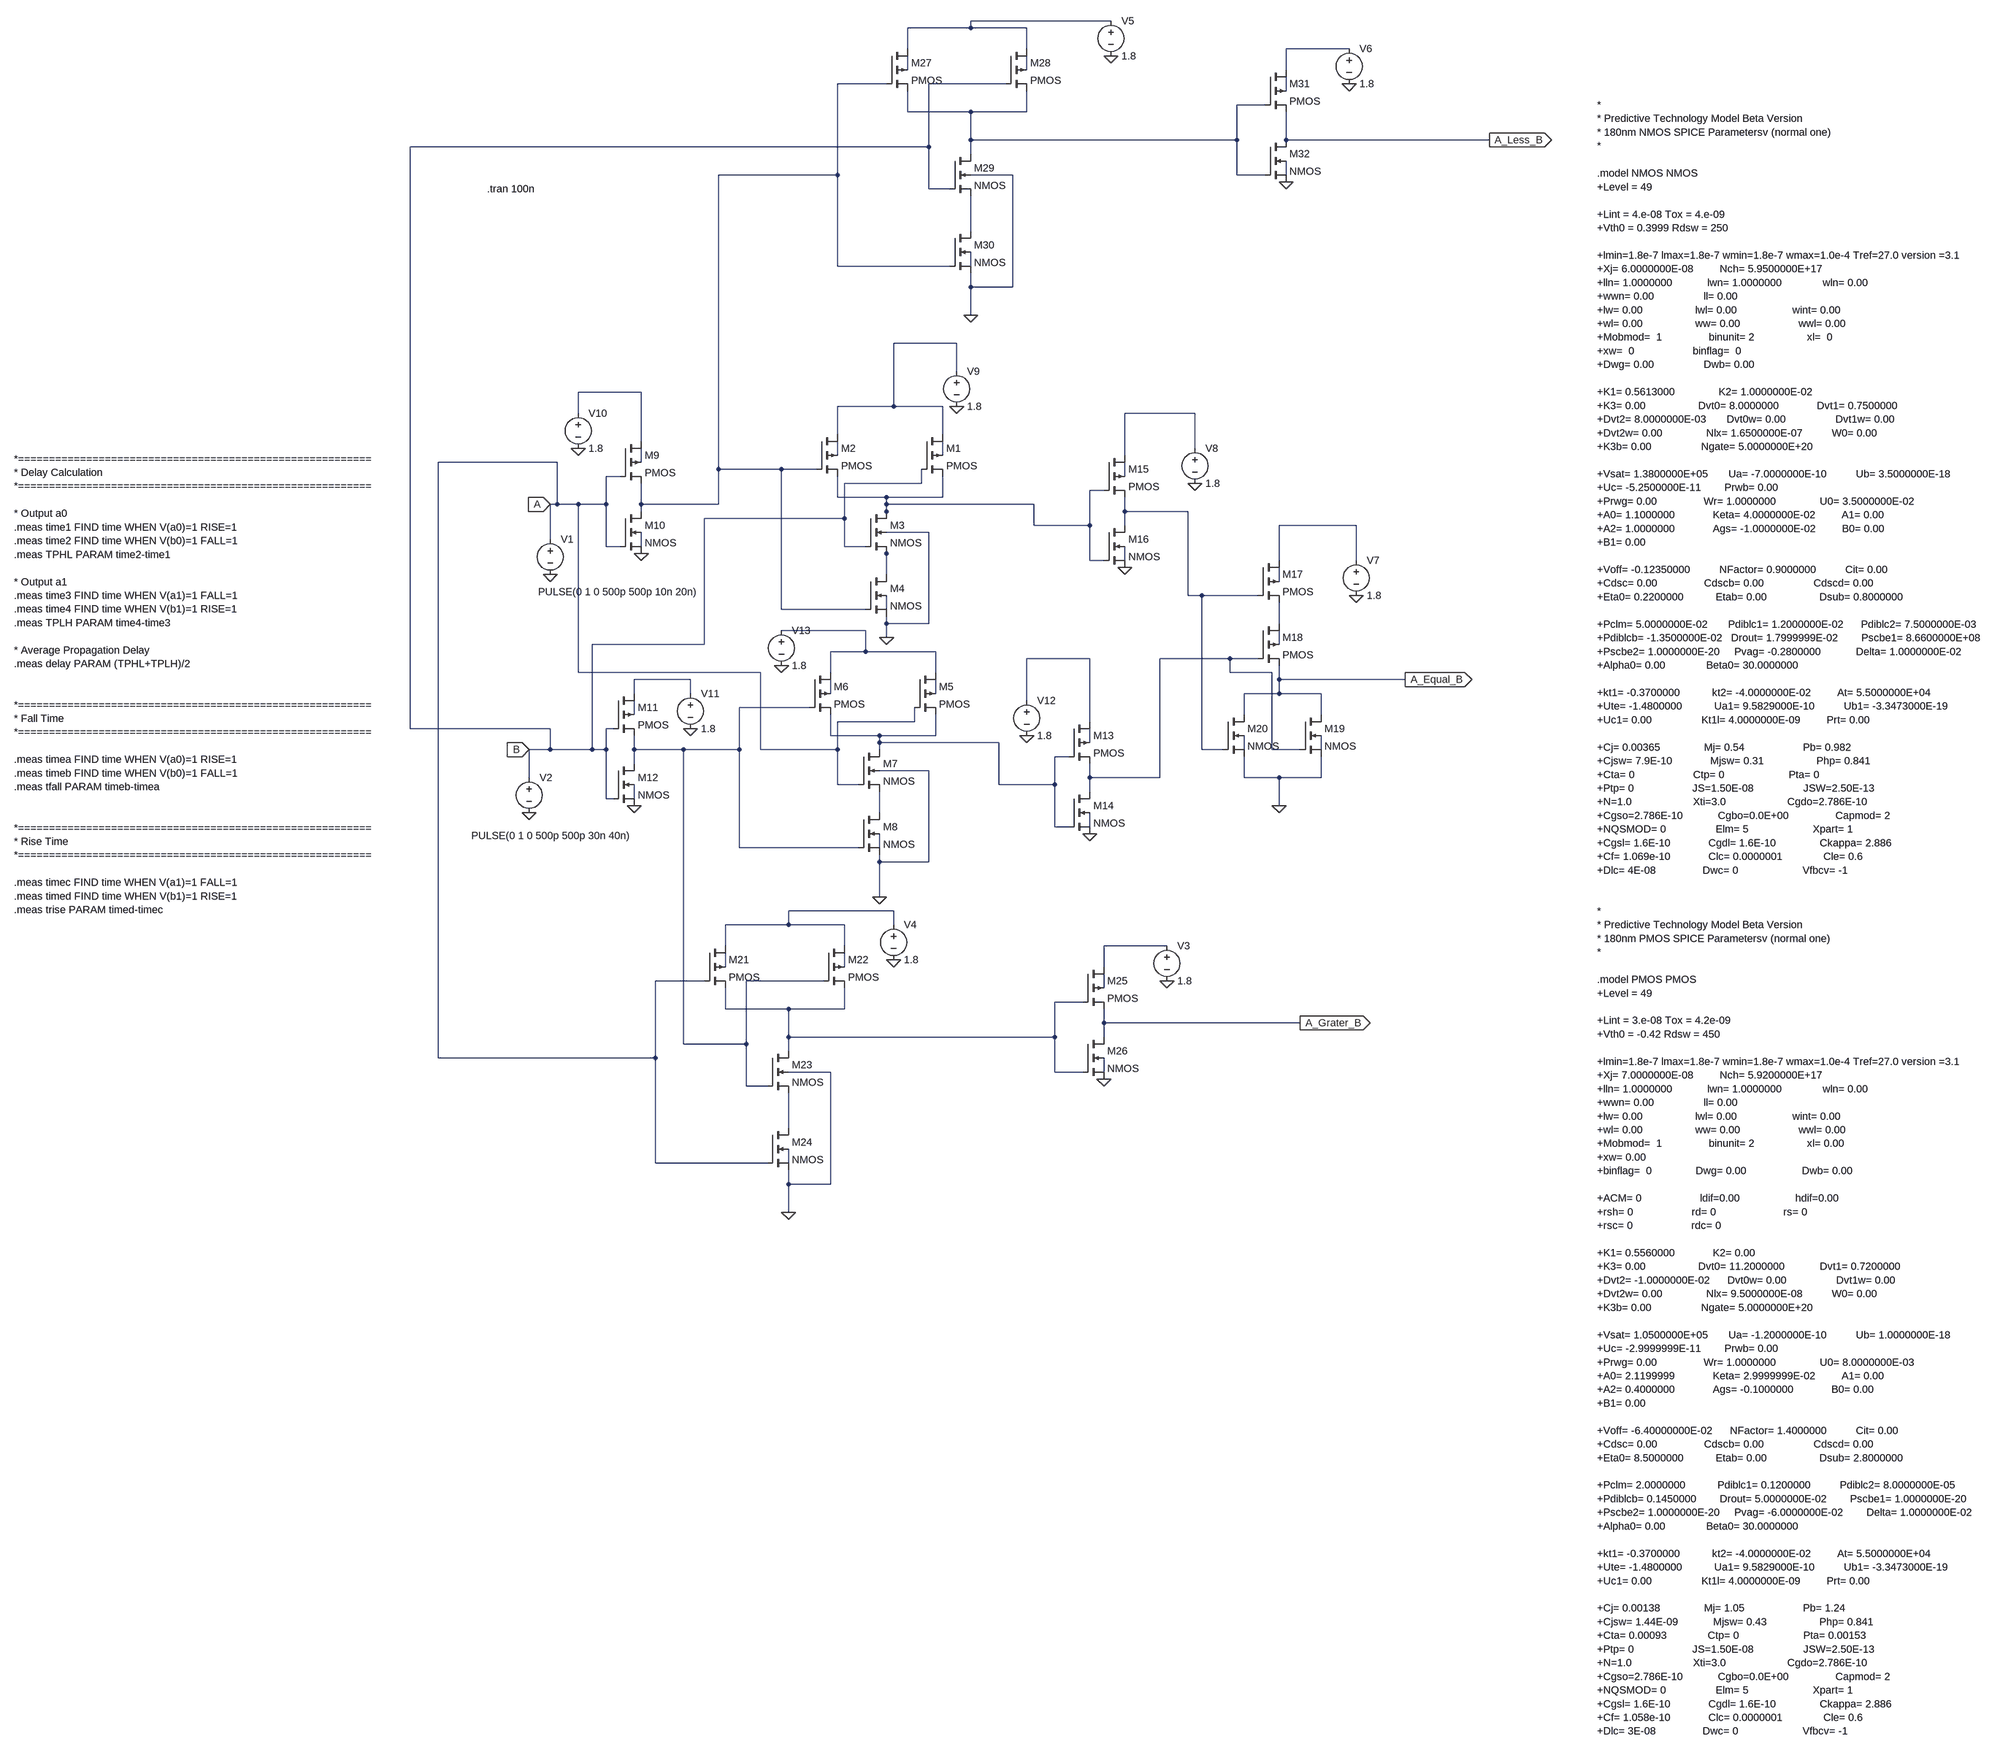
[diagram p0: schematic comparator-static-180nm.asc]
comparator-static-180nm.asc, the LTspice schematic file:
Version 4
SHEET 1 2784 1796
WIRE 672 -1056 352 -1056
WIRE 352 -1040 352 -1056
WIRE 352 -1040 208 -1040
WIRE 480 -1040 352 -1040
WIRE 208 -992 208 -1040
WIRE 480 -992 480 -1040
WIRE 1216 -992 1072 -992
WIRE 208 -944 208 -976
WIRE 480 -944 480 -976
WIRE 1072 -944 1072 -992
WIRE 160 -912 48 -912
WIRE 432 -912 256 -912
WIRE 1072 -896 1072 -928
WIRE 1024 -864 960 -864
WIRE 208 -848 208 -896
WIRE 352 -848 208 -848
WIRE 480 -848 480 -896
WIRE 480 -848 352 -848
WIRE 352 -784 352 -848
WIRE 960 -784 960 -864
WIRE 960 -784 352 -784
WIRE 1072 -784 1072 -848
WIRE 1536 -784 1072 -784
WIRE 256 -768 256 -912
WIRE 256 -768 -928 -768
WIRE 352 -752 352 -784
WIRE 48 -704 48 -912
WIRE 48 -704 -224 -704
WIRE 448 -704 352 -704
WIRE 960 -704 960 -784
WIRE 1024 -704 960 -704
WIRE 1072 -704 1072 -736
WIRE 256 -672 256 -768
WIRE 304 -672 256 -672
WIRE 352 -576 352 -656
WIRE 48 -496 48 -704
WIRE 304 -496 48 -496
WIRE 352 -496 352 -528
WIRE 352 -448 352 -480
WIRE 448 -448 448 -704
WIRE 448 -448 352 -448
WIRE 352 -384 352 -448
WIRE 320 -320 176 -320
WIRE 320 -256 320 -320
WIRE -400 -208 -544 -208
WIRE 176 -176 176 -320
WIRE 176 -176 48 -176
WIRE 288 -176 176 -176
WIRE -544 -160 -544 -208
WIRE 864 -160 704 -160
WIRE 48 -112 48 -176
WIRE 288 -112 288 -176
WIRE -400 -96 -400 -208
WIRE 864 -80 864 -160
WIRE 48 -64 48 -96
WIRE 288 -64 288 -96
WIRE 704 -64 704 -160
WIRE -592 -48 -864 -48
WIRE -400 -48 -400 -80
WIRE -224 -32 -224 -704
WIRE -80 -32 -224 -32
WIRE 0 -32 -80 -32
WIRE -448 -16 -480 -16
WIRE 704 -16 704 -48
WIRE 240 0 240 -32
WIRE 240 0 64 0
WIRE 656 16 624 16
WIRE 48 32 48 -16
WIRE 160 32 48 32
WIRE 288 32 288 -16
WIRE 288 32 160 32
WIRE -592 48 -592 -48
WIRE -592 48 -608 48
WIRE -544 48 -592 48
WIRE -480 48 -480 -16
WIRE -480 48 -544 48
WIRE -400 48 -400 0
WIRE -224 48 -224 -32
WIRE -224 48 -400 48
WIRE 160 48 160 32
WIRE 496 48 160 48
WIRE -400 64 -400 48
WIRE 160 64 160 48
WIRE 704 64 704 32
WIRE 848 64 704 64
WIRE 64 80 64 0
WIRE 64 80 -256 80
WIRE 160 80 160 64
WIRE 496 96 496 48
WIRE 624 96 624 16
WIRE 624 96 496 96
WIRE 704 96 704 64
WIRE 1232 96 1056 96
WIRE 256 112 160 112
WIRE -608 128 -608 48
WIRE -480 144 -480 48
WIRE -448 144 -480 144
WIRE -400 144 -400 112
WIRE 64 144 64 80
WIRE 112 144 64 144
WIRE 160 160 160 144
WIRE 624 176 624 96
WIRE 656 176 624 176
WIRE 704 176 704 144
WIRE 1056 176 1056 96
WIRE 1232 176 1232 96
WIRE 160 208 160 160
WIRE 1056 224 1056 192
WIRE 848 256 848 64
WIRE 880 256 848 256
WIRE 1008 256 880 256
WIRE -80 288 -80 -32
WIRE 112 288 -80 288
WIRE 160 288 160 256
WIRE 160 320 160 304
WIRE 256 320 256 112
WIRE 256 320 160 320
WIRE 1056 320 1056 272
WIRE 112 336 -80 336
WIRE 160 352 160 320
WIRE -256 368 -256 80
WIRE -256 368 -512 368
WIRE 1056 368 1056 336
WIRE 112 384 112 336
WIRE 112 384 32 384
WIRE 272 384 112 384
WIRE 624 400 480 400
WIRE 944 400 784 400
WIRE 1008 400 944 400
WIRE -544 432 -544 48
WIRE -128 432 -544 432
WIRE 32 432 32 384
WIRE 272 432 272 384
WIRE 944 432 944 400
WIRE 1040 432 944 432
WIRE -288 448 -416 448
WIRE 1056 448 1056 416
WIRE 1344 448 1056 448
WIRE -416 480 -416 448
WIRE -288 480 -288 448
WIRE 32 480 32 448
WIRE 272 480 272 448
WIRE 1056 480 1056 448
WIRE 1056 480 976 480
WIRE 1152 480 1056 480
WIRE 480 496 480 400
WIRE -16 512 -176 512
WIRE -416 528 -416 496
WIRE 976 528 976 480
WIRE 1152 528 1152 480
WIRE 224 544 224 512
WIRE 224 544 48 544
WIRE 624 544 624 400
WIRE -928 560 -928 -768
WIRE -608 560 -928 560
WIRE -464 560 -480 560
WIRE 32 576 32 528
WIRE 144 576 32 576
WIRE 272 576 272 528
WIRE 272 576 144 576
WIRE 144 592 144 576
WIRE 416 592 144 592
WIRE 624 592 624 560
WIRE -608 608 -608 560
WIRE -608 608 -656 608
WIRE -512 608 -512 368
WIRE -512 608 -608 608
WIRE -480 608 -480 560
WIRE -480 608 -512 608
WIRE -416 608 -416 576
WIRE -304 608 -416 608
WIRE -176 608 -176 512
WIRE -176 608 -304 608
WIRE -128 608 -128 432
WIRE 48 608 48 544
WIRE 48 608 -128 608
WIRE 144 608 144 592
WIRE 880 608 880 256
WIRE 928 608 880 608
WIRE 976 608 976 576
WIRE 1040 608 1040 432
WIRE 1104 608 1040 608
WIRE 1152 608 1152 576
WIRE 576 624 544 624
WIRE -416 640 -416 608
WIRE 256 656 144 656
WIRE -656 672 -656 608
WIRE 624 672 624 640
WIRE 784 672 784 400
WIRE 784 672 624 672
WIRE 976 672 976 624
WIRE 1056 672 976 672
WIRE 1152 672 1152 624
WIRE 1152 672 1056 672
WIRE 48 688 48 608
WIRE 96 688 48 688
WIRE 416 688 416 592
WIRE 544 688 544 624
WIRE 544 688 416 688
WIRE 624 704 624 672
WIRE -480 720 -480 608
WIRE -464 720 -480 720
WIRE -416 720 -416 688
WIRE 1056 736 1056 672
WIRE 144 752 144 704
WIRE 544 784 544 688
WIRE 576 784 544 784
WIRE 624 784 624 752
WIRE -176 832 -176 608
WIRE 96 832 -176 832
WIRE 144 832 144 800
WIRE 144 864 144 848
WIRE 256 864 256 656
WIRE 256 864 144 864
WIRE 144 944 144 864
WIRE 176 976 -64 976
WIRE -64 1008 -64 976
WIRE -64 1008 -208 1008
WIRE 64 1008 -64 1008
WIRE 176 1008 176 976
WIRE -208 1056 -208 1008
WIRE 64 1056 64 1008
WIRE 800 1056 656 1056
WIRE -208 1104 -208 1072
WIRE 64 1104 64 1072
WIRE 656 1104 656 1056
WIRE -256 1136 -368 1136
WIRE 16 1136 -160 1136
WIRE 656 1152 656 1120
WIRE 608 1184 544 1184
WIRE -208 1200 -208 1152
WIRE -64 1200 -208 1200
WIRE 64 1200 64 1152
WIRE 64 1200 -64 1200
WIRE 656 1232 656 1200
WIRE 1104 1232 656 1232
WIRE -64 1264 -64 1200
WIRE 544 1264 544 1184
WIRE 544 1264 -64 1264
WIRE 656 1264 656 1232
WIRE -304 1280 -304 608
WIRE -160 1280 -160 1136
WIRE -160 1280 -304 1280
WIRE -64 1296 -64 1264
WIRE -864 1312 -864 -48
WIRE -368 1312 -368 1136
WIRE -368 1312 -864 1312
WIRE 32 1344 -64 1344
WIRE 544 1344 544 1264
WIRE 608 1344 544 1344
WIRE 656 1344 656 1312
WIRE -160 1376 -160 1280
WIRE -112 1376 -160 1376
WIRE -64 1472 -64 1392
WIRE -368 1552 -368 1312
WIRE -112 1552 -368 1552
WIRE -64 1552 -64 1520
WIRE -64 1600 -64 1568
WIRE 32 1600 32 1344
WIRE 32 1600 -64 1600
WIRE -64 1664 -64 1600
FLAG 160 352 0
FLAG 144 944 0
FLAG -416 736 0
FLAG -400 160 0
FLAG 624 800 0
FLAG 704 192 0
FLAG 1056 736 0
FLAG -608 208 0
FLAG -656 752 0
FLAG -608 48 A
IOPIN -608 48 In
FLAG -656 608 B
IOPIN -656 608 In
FLAG 1344 448 A_Equal_B
IOPIN 1344 448 Out
FLAG 352 -384 0
FLAG 672 -976 0
FLAG 1536 -784 A_Less_B
IOPIN 1536 -784 Out
FLAG 1072 -688 0
FLAG 1216 -912 0
FLAG 1232 256 0
FLAG 864 0 0
FLAG 320 -176 0
FLAG -544 -80 0
FLAG -288 560 0
FLAG 480 576 0
FLAG -80 416 0
FLAG -64 1664 0
FLAG 656 1360 0
FLAG 800 1136 0
FLAG 176 1088 0
FLAG 1104 1232 A_Grater_B
IOPIN 1104 1232 Out
SYMBOL pmos4 240 -112 R0
SYMATTR InstName M1
SYMATTR Value2 l=180nm w=540nm
SYMBOL pmos4 0 -112 R0
SYMATTR InstName M2
SYMATTR Value2 l=180nm w=540nm
SYMBOL nmos4 112 64 R0
SYMATTR InstName M3
SYMATTR Value2 l=180nm w=540nm
SYMBOL nmos4 112 208 R0
SYMATTR InstName M4
SYMATTR Value2 l=180nm w=540nm
SYMBOL pmos4 224 432 R0
SYMATTR InstName M5
SYMATTR Value2 l=180nm w=540nm
SYMBOL pmos4 -16 432 R0
SYMATTR InstName M6
SYMATTR Value2 l=180nm w=540nm
SYMBOL nmos4 96 608 R0
SYMATTR InstName M7
SYMATTR Value2 l=180nm w=540nm
SYMBOL nmos4 96 752 R0
SYMATTR InstName M8
SYMATTR Value2 l=180nm w=540nm
SYMBOL pmos4 -448 -96 R0
SYMATTR InstName M9
SYMATTR Value2 l=180nm w=540nm
SYMBOL nmos4 -448 64 R0
SYMATTR InstName M10
SYMATTR Value2 l=180nm w=540nm
SYMBOL pmos4 -464 480 R0
SYMATTR InstName M11
SYMATTR Value2 l=180nm w=540nm
SYMBOL nmos4 -464 640 R0
SYMATTR InstName M12
SYMATTR Value2 l=180nm w=540nm
SYMBOL pmos4 576 544 R0
SYMATTR InstName M13
SYMATTR Value2 l=180nm w=540nm
SYMBOL nmos4 576 704 R0
SYMATTR InstName M14
SYMATTR Value2 l=180nm w=540nm
SYMBOL pmos4 656 -64 R0
SYMATTR InstName M15
SYMATTR Value2 l=180nm w=540nm
SYMBOL nmos4 656 96 R0
SYMATTR InstName M16
SYMATTR Value2 l=180nm w=540nm
SYMBOL pmos4 1008 176 R0
SYMATTR InstName M17
SYMATTR Value2 l=180nm w=540nm
SYMBOL pmos4 1008 320 R0
SYMATTR InstName M18
SYMATTR Value2 l=180nm w=540nm
SYMBOL nmos4 1104 528 R0
SYMATTR InstName M19
SYMATTR Value2 l=180nm w=540nm
SYMBOL nmos4 928 528 R0
SYMATTR InstName M20
SYMATTR Value2 l=180nm w=540nm
SYMBOL voltage -608 112 R0
WINDOW 3 -27 136 Left 2
WINDOW 123 0 0 Left 0
WINDOW 39 0 0 Left 0
SYMATTR Value PULSE(0 1 0 500p 500p 10n 20n)
SYMATTR InstName V1
SYMBOL voltage -656 656 R0
WINDOW 3 -132 148 Left 2
WINDOW 123 0 0 Left 0
WINDOW 39 0 0 Left 0
SYMATTR Value PULSE(0 1 0 500p 500p 30n 40n)
SYMATTR InstName V2
SYMBOL pmos4 160 -992 R0
SYMATTR InstName M27
SYMATTR Value2 l=180nm w=540nm
SYMBOL pmos4 432 -992 R0
SYMATTR InstName M28
SYMATTR Value2 l=180nm w=540nm
SYMBOL nmos4 304 -752 R0
SYMATTR InstName M29
SYMATTR Value2 l=180nm w=540nm
SYMBOL nmos4 304 -576 R0
SYMATTR InstName M30
SYMATTR Value2 l=180nm w=540nm
SYMBOL voltage 672 -1072 R0
WINDOW 123 0 0 Left 0
WINDOW 39 0 0 Left 0
SYMATTR InstName V5
SYMATTR Value 1.8
SYMBOL pmos4 1024 -944 R0
SYMATTR InstName M31
SYMATTR Value2 l=180nm w=540nm
SYMBOL nmos4 1024 -784 R0
SYMATTR InstName M32
SYMATTR Value2 l=180nm w=540nm
SYMBOL voltage 1216 -1008 R0
WINDOW 123 0 0 Left 0
WINDOW 39 0 0 Left 0
SYMATTR InstName V6
SYMATTR Value 1.8
SYMBOL voltage 1232 160 R0
WINDOW 123 0 0 Left 0
WINDOW 39 0 0 Left 0
SYMATTR InstName V7
SYMATTR Value 1.8
SYMBOL voltage 864 -96 R0
WINDOW 123 0 0 Left 0
WINDOW 39 0 0 Left 0
SYMATTR InstName V8
SYMATTR Value 1.8
SYMBOL voltage 320 -272 R0
WINDOW 123 0 0 Left 0
WINDOW 39 0 0 Left 0
SYMATTR InstName V9
SYMATTR Value 1.8
SYMBOL voltage -544 -176 R0
WINDOW 123 0 0 Left 0
WINDOW 39 0 0 Left 0
SYMATTR InstName V10
SYMATTR Value 1.8
SYMBOL voltage -288 464 R0
WINDOW 123 0 0 Left 0
WINDOW 39 0 0 Left 0
SYMATTR InstName V11
SYMATTR Value 1.8
SYMBOL voltage 480 480 R0
WINDOW 123 0 0 Left 0
WINDOW 39 0 0 Left 0
SYMATTR InstName V12
SYMATTR Value 1.8
SYMBOL voltage -80 320 R0
WINDOW 123 0 0 Left 0
WINDOW 39 0 0 Left 0
SYMATTR InstName V13
SYMATTR Value 1.8
SYMBOL pmos4 -256 1056 R0
SYMATTR InstName M21
SYMATTR Value2 l=180nm w=540nm
SYMBOL pmos4 16 1056 R0
SYMATTR InstName M22
SYMATTR Value2 l=180nm w=540nm
SYMBOL nmos4 -112 1296 R0
SYMATTR InstName M23
SYMATTR Value2 l=180nm w=540nm
SYMBOL nmos4 -112 1472 R0
SYMATTR InstName M24
SYMATTR Value2 l=180nm w=540nm
SYMBOL pmos4 608 1104 R0
SYMATTR InstName M25
SYMATTR Value2 l=180nm w=540nm
SYMBOL nmos4 608 1264 R0
SYMATTR InstName M26
SYMATTR Value2 l=180nm w=540nm
SYMBOL voltage 800 1040 R0
WINDOW 123 0 0 Left 0
WINDOW 39 0 0 Left 0
SYMATTR InstName V3
SYMATTR Value 1.8
SYMBOL voltage 176 992 R0
WINDOW 123 0 0 Left 0
WINDOW 39 0 0 Left 0
SYMATTR InstName V4
SYMATTR Value 1.8
TEXT -752 -672 Left 2 !.tran 100n
TEXT 2024 -864 Left 2 !*\n* Predictive Technology Model Beta Version\n* 180nm NMOS SPICE Parametersv (normal one)\n*\n \n.model NMOS NMOS\n+Level = 49\n \n+Lint = 4.e-08 Tox = 4.e-09 \n+Vth0 = 0.3999 Rdsw = 250 \n \n+lmin=1.8e-7 lmax=1.8e-7 wmin=1.8e-7 wmax=1.0e-4 Tref=27.0 version =3.1\n+Xj= 6.0000000E-08         Nch= 5.9500000E+17 \n+lln= 1.0000000            lwn= 1.0000000              wln= 0.00\n+wwn= 0.00                 ll= 0.00\n+lw= 0.00                  lwl= 0.00                   wint= 0.00\n+wl= 0.00                  ww= 0.00                    wwl= 0.00\n+Mobmod=  1                binunit= 2                  xl=  0\n+xw=  0                    binflag=  0\n+Dwg= 0.00                 Dwb= 0.00 \n \n+K1= 0.5613000               K2= 1.0000000E-02 \n+K3= 0.00                  Dvt0= 8.0000000             Dvt1= 0.7500000 \n+Dvt2= 8.0000000E-03       Dvt0w= 0.00                 Dvt1w= 0.00 \n+Dvt2w= 0.00               Nlx= 1.6500000E-07          W0= 0.00 \n+K3b= 0.00                 Ngate= 5.0000000E+20 \n \n+Vsat= 1.3800000E+05       Ua= -7.0000000E-10          Ub= 3.5000000E-18 \n+Uc= -5.2500000E-11        Prwb= 0.00 \n+Prwg= 0.00                Wr= 1.0000000               U0= 3.5000000E-02 \n+A0= 1.1000000             Keta= 4.0000000E-02         A1= 0.00 \n+A2= 1.0000000             Ags= -1.0000000E-02         B0= 0.00 \n+B1= 0.00 \n \n+Voff= -0.12350000          NFactor= 0.9000000          Cit= 0.00 \n+Cdsc= 0.00                Cdscb= 0.00                 Cdscd= 0.00 \n+Eta0= 0.2200000           Etab= 0.00                  Dsub= 0.8000000 \n \n+Pclm= 5.0000000E-02       Pdiblc1= 1.2000000E-02      Pdiblc2= 7.5000000E-03 \n+Pdiblcb= -1.3500000E-02   Drout= 1.7999999E-02        Pscbe1= 8.6600000E+08 \n+Pscbe2= 1.0000000E-20     Pvag= -0.2800000            Delta= 1.0000000E-02 \n+Alpha0= 0.00              Beta0= 30.0000000 \n \n+kt1= -0.3700000           kt2= -4.0000000E-02         At= 5.5000000E+04 \n+Ute= -1.4800000           Ua1= 9.5829000E-10          Ub1= -3.3473000E-19 \n+Uc1= 0.00                 Kt1l= 4.0000000E-09         Prt= 0.00 \n \n+Cj= 0.00365               Mj= 0.54                    Pb= 0.982\n+Cjsw= 7.9E-10             Mjsw= 0.31                  Php= 0.841\n+Cta= 0                    Ctp= 0                      Pta= 0\n+Ptp= 0                    JS=1.50E-08                 JSW=2.50E-13\n+N=1.0                     Xti=3.0                     Cgdo=2.786E-10\n+Cgso=2.786E-10            Cgbo=0.0E+00                Capmod= 2\n+NQSMOD= 0                 Elm= 5                      Xpart= 1\n+Cgsl= 1.6E-10             Cgdl= 1.6E-10               Ckappa= 2.886\n+Cf= 1.069e-10             Clc= 0.0000001              Cle= 0.6\n+Dlc= 4E-08                Dwc= 0                      Vfbcv= -1\n \n\n*\n* Predictive Technology Model Beta Version\n* 180nm PMOS SPICE Parametersv (normal one)\n*\n \n.model PMOS PMOS\n+Level = 49\n \n+Lint = 3.e-08 Tox = 4.2e-09 \n+Vth0 = -0.42 Rdsw = 450 \n \n+lmin=1.8e-7 lmax=1.8e-7 wmin=1.8e-7 wmax=1.0e-4 Tref=27.0 version =3.1\n+Xj= 7.0000000E-08         Nch= 5.9200000E+17 \n+lln= 1.0000000            lwn= 1.0000000              wln= 0.00\n+wwn= 0.00                 ll= 0.00\n+lw= 0.00                  lwl= 0.00                   wint= 0.00\n+wl= 0.00                  ww= 0.00                    wwl= 0.00\n+Mobmod=  1                binunit= 2                  xl= 0.00\n+xw= 0.00                  \n+binflag=  0               Dwg= 0.00                   Dwb= 0.00 \n \n+ACM= 0                    ldif=0.00                   hdif=0.00\n+rsh= 0                    rd= 0                       rs= 0\n+rsc= 0                    rdc= 0\n \n+K1= 0.5560000             K2= 0.00 \n+K3= 0.00                  Dvt0= 11.2000000            Dvt1= 0.7200000 \n+Dvt2= -1.0000000E-02      Dvt0w= 0.00                 Dvt1w= 0.00 \n+Dvt2w= 0.00               Nlx= 9.5000000E-08          W0= 0.00 \n+K3b= 0.00                 Ngate= 5.0000000E+20 \n \n+Vsat= 1.0500000E+05       Ua= -1.2000000E-10          Ub= 1.0000000E-18 \n+Uc= -2.9999999E-11        Prwb= 0.00 \n+Prwg= 0.00                Wr= 1.0000000               U0= 8.0000000E-03 \n+A0= 2.1199999             Keta= 2.9999999E-02         A1= 0.00 \n+A2= 0.4000000             Ags= -0.1000000             B0= 0.00 \n+B1= 0.00 \n \n+Voff= -6.40000000E-02      NFactor= 1.4000000          Cit= 0.00 \n+Cdsc= 0.00                Cdscb= 0.00                 Cdscd= 0.00 \n+Eta0= 8.5000000           Etab= 0.00                  Dsub= 2.8000000 \n \n+Pclm= 2.0000000           Pdiblc1= 0.1200000          Pdiblc2= 8.0000000E-05 \n+Pdiblcb= 0.1450000        Drout= 5.0000000E-02        Pscbe1= 1.0000000E-20 \n+Pscbe2= 1.0000000E-20     Pvag= -6.0000000E-02        Delta= 1.0000000E-02 \n+Alpha0= 0.00              Beta0= 30.0000000 \n \n+kt1= -0.3700000           kt2= -4.0000000E-02         At= 5.5000000E+04 \n+Ute= -1.4800000           Ua1= 9.5829000E-10          Ub1= -3.3473000E-19 \n+Uc1= 0.00                 Kt1l= 4.0000000E-09         Prt= 0.00 \n \n+Cj= 0.00138               Mj= 1.05                    Pb= 1.24\n+Cjsw= 1.44E-09            Mjsw= 0.43                  Php= 0.841\n+Cta= 0.00093              Ctp= 0                      Pta= 0.00153\n+Ptp= 0                    JS=1.50E-08                 JSW=2.50E-13\n+N=1.0                     Xti=3.0                     Cgdo=2.786E-10\n+Cgso=2.786E-10            Cgbo=0.0E+00                Capmod= 2\n+NQSMOD= 0                 Elm= 5                      Xpart= 1\n+Cgsl= 1.6E-10             Cgdl= 1.6E-10               Ckappa= 2.886\n+Cf= 1.058e-10             Clc= 0.0000001              Cle= 0.6\n+Dlc= 3E-08                Dwc= 0                      Vfbcv= -1
TEXT -1832 -56 Left 2 !*=========================================================\n* Delay Calculation\n*=========================================================\n \n* Output a0\n.meas time1 FIND time WHEN V(a0)=1 RISE=1\n.meas time2 FIND time WHEN V(b0)=1 FALL=1\n.meas TPHL PARAM time2-time1\n \n* Output a1\n.meas time3 FIND time WHEN V(a1)=1 FALL=1\n.meas time4 FIND time WHEN V(b1)=1 RISE=1\n.meas TPLH PARAM time4-time3\n \n* Average Propagation Delay\n.meas delay PARAM (TPHL+TPLH)/2\n \n\n*=========================================================\n* Fall Time\n*=========================================================\n \n.meas timea FIND time WHEN V(a0)=1 RISE=1\n.meas timeb FIND time WHEN V(b0)=1 FALL=1\n.meas tfall PARAM timeb-timea\n \n\n*=========================================================\n* Rise Time\n*=========================================================\n \n.meas timec FIND time WHEN V(a1)=1 FALL=1\n.meas timed FIND time WHEN V(b1)=1 RISE=1\n.meas trise PARAM timed-timec

The netlist it stands for:
* comparator-static-180nm.asc
M1 N011 B N018 N015 PMOS l=180nm w=540nm
M2 N011 N005 N018 N014 PMOS l=180nm w=540nm
M3 N018 B N022 0 NMOS l=180nm w=540nm
M4 N022 N005 0 N025 NMOS l=180nm w=540nm
M5 N027 A N036 N033 PMOS l=180nm w=540nm
M6 N027 N034 N036 N032 PMOS l=180nm w=540nm
M7 N036 A N041 0 NMOS l=180nm w=540nm
M8 N041 N034 0 N043 NMOS l=180nm w=540nm
M9 N012 A N005 N016 PMOS l=180nm w=540nm
M10 N005 A 0 N021 NMOS l=180nm w=540nm
M11 N031 B N034 N035 PMOS l=180nm w=540nm
M12 N034 B 0 N040 NMOS l=180nm w=540nm
M13 N029 N036 N030 N037 PMOS l=180nm w=540nm
M14 N030 N036 0 N042 NMOS l=180nm w=540nm
M15 N013 N018 N019 N017 PMOS l=180nm w=540nm
M16 N019 N018 0 N023 NMOS l=180nm w=540nm
M17 N020 N019 N026 N024 PMOS l=180nm w=540nm
M18 N026 N030 A_Equal_B N028 PMOS l=180nm w=540nm
M19 A_Equal_B N030 0 N039 NMOS l=180nm w=540nm
M20 A_Equal_B N019 0 N038 NMOS l=180nm w=540nm
V1 A 0 PULSE(0 1 0 500p 500p 10n 20n)
V2 B 0 PULSE(0 1 0 500p 500p 30n 40n)
M27 N001 N005 N007 N003 PMOS l=180nm w=540nm
M28 N001 B N007 N004 PMOS l=180nm w=540nm
M29 N007 B N009 0 NMOS l=180nm w=540nm
M30 N009 N005 0 N010 NMOS l=180nm w=540nm
V5 N001 0 1.8
M31 N002 N007 A_Less_B N006 PMOS l=180nm w=540nm
M32 A_Less_B N007 0 N008 NMOS l=180nm w=540nm
V6 N002 0 1.8
V7 N020 0 1.8
V8 N013 0 1.8
V9 N011 0 1.8
V10 N012 0 1.8
V11 N031 0 1.8
V12 N029 0 1.8
V13 N027 0 1.8
M21 N044 A N049 N046 PMOS l=180nm w=540nm
M22 N044 N034 N049 N047 PMOS l=180nm w=540nm
M23 N049 N034 N051 0 NMOS l=180nm w=540nm
M24 N051 A 0 N052 NMOS l=180nm w=540nm
M25 N045 N049 A_Grater_B N048 PMOS l=180nm w=540nm
M26 A_Grater_B N049 0 N050 NMOS l=180nm w=540nm
V3 N045 0 1.8
V4 N044 0 1.8
.model NMOS NMOS
.model PMOS PMOS
.lib standard.mos
.tran 100n
*
* Predictive Technology Model Beta Version
* 180nm NMOS SPICE Parametersv (normal one)
*
.model NMOS NMOS
+Level = 49
+Lint = 4.e-08 Tox = 4.e-09
+Vth0 = 0.3999 Rdsw = 250
+lmin=1.8e-7 lmax=1.8e-7 wmin=1.8e-7 wmax=1.0e-4 Tref=27.0 version =3.1
+Xj= 6.0000000E-08         Nch= 5.9500000E+17
+lln= 1.0000000            lwn= 1.0000000              wln= 0.00
+wwn= 0.00                 ll= 0.00
+lw= 0.00                  lwl= 0.00                   wint= 0.00
+wl= 0.00                  ww= 0.00                    wwl= 0.00
+Mobmod=  1                binunit= 2                  xl=  0
+xw=  0                    binflag=  0
+Dwg= 0.00                 Dwb= 0.00
+K1= 0.5613000               K2= 1.0000000E-02
+K3= 0.00                  Dvt0= 8.0000000             Dvt1= 0.7500000
+Dvt2= 8.0000000E-03       Dvt0w= 0.00                 Dvt1w= 0.00
+Dvt2w= 0.00               Nlx= 1.6500000E-07          W0= 0.00
+K3b= 0.00                 Ngate= 5.0000000E+20
+Vsat= 1.3800000E+05       Ua= -7.0000000E-10          Ub= 3.5000000E-18
+Uc= -5.2500000E-11        Prwb= 0.00
+Prwg= 0.00                Wr= 1.0000000               U0= 3.5000000E-02
+A0= 1.1000000             Keta= 4.0000000E-02         A1= 0.00
+A2= 1.0000000             Ags= -1.0000000E-02         B0= 0.00
+B1= 0.00
+Voff= -0.12350000          NFactor= 0.9000000          Cit= 0.00
+Cdsc= 0.00                Cdscb= 0.00                 Cdscd= 0.00
+Eta0= 0.2200000           Etab= 0.00                  Dsub= 0.8000000
+Pclm= 5.0000000E-02       Pdiblc1= 1.2000000E-02      Pdiblc2= 7.5000000E-03
+Pdiblcb= -1.3500000E-02   Drout= 1.7999999E-02        Pscbe1= 8.6600000E+08
+Pscbe2= 1.0000000E-20     Pvag= -0.2800000            Delta= 1.0000000E-02
+Alpha0= 0.00              Beta0= 30.0000000
+kt1= -0.3700000           kt2= -4.0000000E-02         At= 5.5000000E+04
+Ute= -1.4800000           Ua1= 9.5829000E-10          Ub1= -3.3473000E-19
+Uc1= 0.00                 Kt1l= 4.0000000E-09         Prt= 0.00
+Cj= 0.00365               Mj= 0.54                    Pb= 0.982
+Cjsw= 7.9E-10             Mjsw= 0.31                  Php= 0.841
+Cta= 0                    Ctp= 0                      Pta= 0
+Ptp= 0                    JS=1.50E-08                 JSW=2.50E-13
+N=1.0                     Xti=3.0                     Cgdo=2.786E-10
+Cgso=2.786E-10            Cgbo=0.0E+00                Capmod= 2
+NQSMOD= 0                 Elm= 5                      Xpart= 1
+Cgsl= 1.6E-10             Cgdl= 1.6E-10               Ckappa= 2.886
+Cf= 1.069e-10             Clc= 0.0000001              Cle= 0.6
+Dlc= 4E-08                Dwc= 0                      Vfbcv= -1
*
* Predictive Technology Model Beta Version
* 180nm PMOS SPICE Parametersv (normal one)
*
.model PMOS PMOS
+Level = 49
+Lint = 3.e-08 Tox = 4.2e-09
+Vth0 = -0.42 Rdsw = 450
+lmin=1.8e-7 lmax=1.8e-7 wmin=1.8e-7 wmax=1.0e-4 Tref=27.0 version =3.1
+Xj= 7.0000000E-08         Nch= 5.9200000E+17
+lln= 1.0000000            lwn= 1.0000000              wln= 0.00
+wwn= 0.00                 ll= 0.00
+lw= 0.00                  lwl= 0.00                   wint= 0.00
+wl= 0.00                  ww= 0.00                    wwl= 0.00
+Mobmod=  1                binunit= 2                  xl= 0.00
+xw= 0.00
+binflag=  0               Dwg= 0.00                   Dwb= 0.00
+ACM= 0                    ldif=0.00                   hdif=0.00
+rsh= 0                    rd= 0                       rs= 0
+rsc= 0                    rdc= 0
+K1= 0.5560000             K2= 0.00
+K3= 0.00                  Dvt0= 11.2000000            Dvt1= 0.7200000
+Dvt2= -1.0000000E-02      Dvt0w= 0.00                 Dvt1w= 0.00
+Dvt2w= 0.00               Nlx= 9.5000000E-08          W0= 0.00
+K3b= 0.00                 Ngate= 5.0000000E+20
+Vsat= 1.0500000E+05       Ua= -1.2000000E-10          Ub= 1.0000000E-18
+Uc= -2.9999999E-11        Prwb= 0.00
+Prwg= 0.00                Wr= 1.0000000               U0= 8.0000000E-03
+A0= 2.1199999             Keta= 2.9999999E-02         A1= 0.00
+A2= 0.4000000             Ags= -0.1000000             B0= 0.00
+B1= 0.00
+Voff= -6.40000000E-02      NFactor= 1.4000000          Cit= 0.00
+Cdsc= 0.00                Cdscb= 0.00                 Cdscd= 0.00
+Eta0= 8.5000000           Etab= 0.00                  Dsub= 2.8000000
+Pclm= 2.0000000           Pdiblc1= 0.1200000          Pdiblc2= 8.0000000E-05
+Pdiblcb= 0.1450000        Drout= 5.0000000E-02        Pscbe1= 1.0000000E-20
+Pscbe2= 1.0000000E-20     Pvag= -6.0000000E-02        Delta= 1.0000000E-02
+Alpha0= 0.00              Beta0= 30.0000000
+kt1= -0.3700000           kt2= -4.0000000E-02         At= 5.5000000E+04
+Ute= -1.4800000           Ua1= 9.5829000E-10          Ub1= -3.3473000E-19
+Uc1= 0.00                 Kt1l= 4.0000000E-09         Prt= 0.00
+Cj= 0.00138               Mj= 1.05                    Pb= 1.24
+Cjsw= 1.44E-09            Mjsw= 0.43                  Php= 0.841
+Cta= 0.00093              Ctp= 0                      Pta= 0.00153
+Ptp= 0                    JS=1.50E-08                 JSW=2.50E-13
+N=1.0                     Xti=3.0                     Cgdo=2.786E-10
+Cgso=2.786E-10            Cgbo=0.0E+00                Capmod= 2
+NQSMOD= 0                 Elm= 5                      Xpart= 1
+Cgsl= 1.6E-10             Cgdl= 1.6E-10               Ckappa= 2.886
+Cf= 1.058e-10             Clc= 0.0000001              Cle= 0.6
+Dlc= 3E-08                Dwc= 0                      Vfbcv= -1
*=========================================================
* Delay Calculation
*=========================================================
* Output a0
.meas time1 FIND time WHEN V(a0)=1 RISE=1
.meas time2 FIND time WHEN V(b0)=1 FALL=1
.meas TPHL PARAM time2-time1
* Output a1
.meas time3 FIND time WHEN V(a1)=1 FALL=1
.meas time4 FIND time WHEN V(b1)=1 RISE=1
.meas TPLH PARAM time4-time3
* Average Propagation Delay
.meas delay PARAM (TPHL+TPLH)/2
*=========================================================
* Fall Time
*=========================================================
.meas timea FIND time WHEN V(a0)=1 RISE=1
.meas timeb FIND time WHEN V(b0)=1 FALL=1
.meas tfall PARAM timeb-timea
*=========================================================
* Rise Time
*=========================================================
.meas timec FIND time WHEN V(a1)=1 FALL=1
.meas timed FIND time WHEN V(b1)=1 RISE=1
.meas trise PARAM timed-timec
.backanno
.end